# EAGLE schematic basic-schematic-usb (EAGLE 7.3.0)
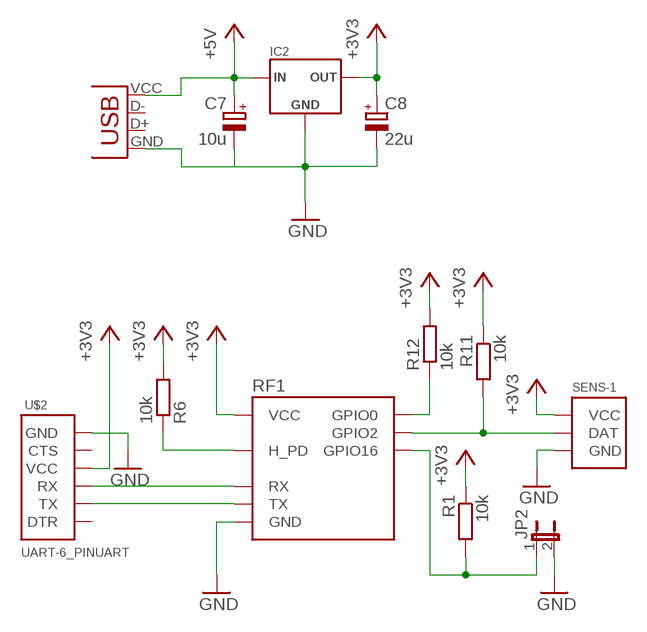
[diagram p0: schematic, sheet 1]

## Parts
C7  10u  CPOL-EUE2.5-6  [E2,5-6]
C8  22u  CPOL-EUE2.5-6  [E2,5-6]
CON1  USB2.5-2.0-2.5  [USB-FEMALE-A]
IC2  REGULATOR-UA78M33TO220  [TO220V]
JP2  JP1E  [JP1]
R1  10k  R-EU_0207/7  [0207/7]
R6  10k  R-EU_0207/7  [0207/7]
R11  10k  R-EU_0207/7  [0207/7]
R12  10k  R-EU_0207/7  [0207/7]
RF1  ESP2866-ESP-01THT  [ESP8266-ESP-01]
SENS-1  DHT11DHT11  [SENSOR-DHT11]
U$2  UART-6_PINUART  [ANGLE-1X6]

## Nets
+3V3: C8.+ IC2.3(OUT) R1.1 R6.2 R11.1 R12.2 RF1.VCC SENS-1.P$1(VCC) U$2.3(VCC)
+5V: C7.+ CON1.VCC(VBUS) IC2.1(IN)
GND: C7.- C8.- CON1.GND IC2.2(GND) JP2.2 RF1.GND SENS-1.P$4(GND) U$2.1(GND)
IO0: R12.1 RF1.GPIO0
IO2: R11.2 RF1.GPIO2 SENS-1.P$2(DAT)
IO16: JP2.1 R1.2 RF1.GPIO16
RESET: R6.1 RF1.H_PD
RX: RF1.RX U$2.4(RX)
TX: RF1.TX U$2.5(TX)
Unconnected: CON1.D+ CON1.D- U$2.2(CTS) U$2.6(DTR)

## Library data of the parts
C7 C8 = rcl:CPOL-EU: POLARIZED CAPACITOR, European symbol
CON1 = p.peter-connectors:USB
IC2 = p.peter-regulators:REGULATOR-UA78M33
JP2 = jumper:JP1E: JUMPER
R1 R6 R11 R12 = rcl:R-EU_: RESISTOR, European symbol
RF1 = p.peter-periphery:ESP2866-ESP-01
SENS-1 = p.peter-periphery:DHT11
U$2 = p.peter-connectors:UART-6_PIN: RX and TX direction as seen from outside. I.e. connect RX from connector to RX from Atmega